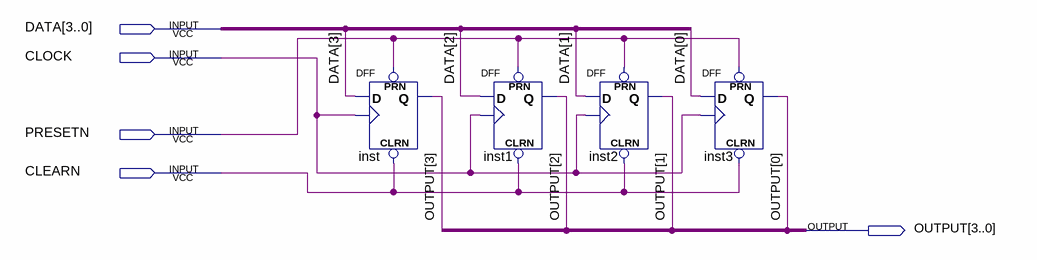
[diagram p0: schematic sheet]
// Quartus schematic REGISTER_4BIT.bdf as structural Verilog: 4 symbols, 5 pins
module REGISTER_4BIT (
  input  [3:0] DATA,
  input  CLOCK,
  input  PRESETN,
  input  CLEARN,
  output [3:0] OUTPUT
);

  DFF inst (.CLRN(CLEARN), .CLK(CLOCK), .D(DATA[3]), .PRN(PRESETN), .Q(OUTPUT[3]));
  DFF inst1 (.CLRN(CLEARN), .CLK(CLOCK), .D(DATA[2]), .PRN(PRESETN), .Q(OUTPUT[2]));
  DFF inst2 (.CLRN(CLEARN), .CLK(CLOCK), .D(DATA[1]), .PRN(PRESETN), .Q(OUTPUT[1]));
  DFF inst3 (.CLRN(CLEARN), .CLK(CLOCK), .D(DATA[0]), .PRN(PRESETN), .Q(OUTPUT[0]));
endmodule
